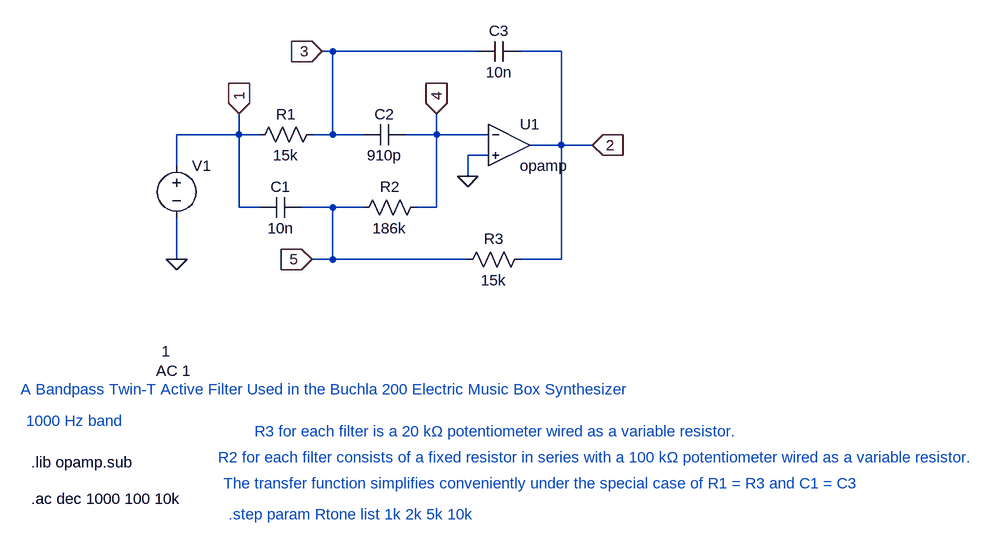
[diagram p0: schematic Bandpass-Twin-T-Active-Filter.asc]
Bandpass-Twin-T-Active-Filter.asc, the LTspice schematic file:
Version 4
SHEET 1 1056 712
WIRE -80 -16 -96 -16
WIRE 144 -16 -80 -16
WIRE 272 -16 208 -16
WIRE -224 112 -224 80
WIRE -224 112 -320 112
WIRE -192 112 -224 112
WIRE -80 112 -80 -16
WIRE -80 112 -112 112
WIRE -32 112 -80 112
WIRE 80 112 80 80
WIRE 80 112 32 112
WIRE 160 112 80 112
WIRE 272 128 272 -16
WIRE 272 128 224 128
WIRE 320 128 272 128
WIRE 160 144 128 144
WIRE -320 160 -320 112
WIRE 128 176 128 144
WIRE -224 224 -224 112
WIRE -192 224 -224 224
WIRE -80 224 -128 224
WIRE -32 224 -80 224
WIRE 80 224 80 112
WIRE 80 224 48 224
WIRE -320 304 -320 240
WIRE -80 304 -80 224
WIRE -80 304 -112 304
WIRE 128 304 -80 304
WIRE 272 304 272 128
WIRE 272 304 208 304
FLAG 128 176 0
FLAG -320 304 0
FLAG -224 80 1
IOPIN -224 80 In
FLAG 320 128 2
IOPIN 320 128 In
FLAG -96 -16 3
IOPIN -96 -16 In
FLAG -112 304 5
IOPIN -112 304 In
FLAG 80 80 4
IOPIN 80 80 In
SYMBOL res -96 96 R90
WINDOW 0 0 56 VBottom 2
WINDOW 3 32 56 VTop 2
SYMATTR InstName R1
SYMATTR Value 15k
SYMBOL res 64 208 R90
WINDOW 0 0 56 VBottom 2
WINDOW 3 32 56 VTop 2
SYMATTR InstName R2
SYMATTR Value 186k
SYMBOL res 224 288 R90
WINDOW 0 0 56 VBottom 2
WINDOW 3 32 56 VTop 2
SYMATTR InstName R3
SYMATTR Value 15k
SYMBOL cap -128 208 R90
WINDOW 0 0 32 VBottom 2
WINDOW 3 32 32 VTop 2
SYMATTR InstName C1
SYMATTR Value 10n
SYMBOL cap 32 96 R90
WINDOW 0 0 32 VBottom 2
WINDOW 3 32 32 VTop 2
SYMATTR InstName C2
SYMATTR Value 910p
SYMBOL cap 208 -32 R90
WINDOW 0 0 32 VBottom 2
WINDOW 3 32 32 VTop 2
SYMATTR InstName C3
SYMATTR Value 10n
SYMBOL OpAmps\\opamp 192 64 R0
SYMATTR InstName U1
SYMBOL voltage -320 144 R0
WINDOW 3 -23 301 Left 2
WINDOW 123 -32 331 Left 2
WINDOW 39 0 0 Left 0
SYMATTR Value 1
SYMATTR Value2 AC 1
SYMATTR InstName V1
TEXT -560 504 Left 2 ;A Bandpass Twin-T Active Filter Used in the Buchla 200 Electric Music Box Synthesizer
TEXT -552 552 Left 2 ;1000 Hz band
TEXT -544 616 Left 2 !.lib opamp.sub
TEXT -544 672 Left 2 !.ac dec 1000 100 10k
TEXT -200 568 Left 2 ;R3 for each filter is a 20 kΩ potentiometer wired as a variable resistor.
TEXT -256 608 Left 2 ;R2 for each filter consists of a fixed resistor in series with a 100 kΩ potentiometer wired as a variable resistor.
TEXT -248 648 Left 2 ;The transfer function simplifies conveniently under the special case of R1 = R3 and C1 = C3
TEXT -240 696 Left 2 ;.step param Rtone list 1k 2k 5k 10k

The netlist it stands for:
* Bandpass-Twin-T-Active-Filter.asc
R1 3 1 15k
R2 4 5 186k
R3 2 5 15k
C1 5 1 10n
C2 4 3 910p
C3 2 3 10n
XU1 4 0 2 opamp Aol=100K GBW=10Meg  ; pins invin noninvin out
V1 1 0 1 AC 1
* A Bandpass Twin-T Active Filter Used in the Buchla 200 Electric Music Box Synthesizer
* 1000 Hz band
.lib opamp.sub
.ac dec 1000 100 10k
* R3 for each filter is a 20 kΩ potentiometer wired as a variable resistor.
* R2 for each filter consists of a fixed resistor in series with a 100 kΩ potentiometer wired as a variable resistor.
* The transfer function simplifies conveniently under the special case of R1 = R3 and C1 = C3
* .step param Rtone list 1k 2k 5k 10k
.backanno
.end